# EAGLE schematic Lcd connector (EAGLE 5.08)
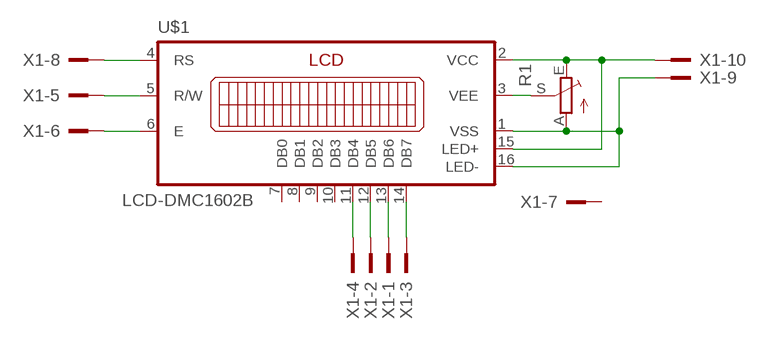
[diagram p0: schematic, sheet 1]

## Parts
R1  TRIM_EU-CA9V  [CA9V]
U$1  LCD-DMC1602B  [DMC1602B]
X1  2510-  [PAK100/2500-10]

## Nets
N$1: U$1.13(DB6) X1.1
N$2: U$1.12(DB5) X1.2
N$3: U$1.14(DB7) X1.3
N$4: U$1.11(DB4) X1.4
N$5: U$1.4(RS) X1.8
N$6: U$1.6(E) X1.6
N$7: U$1.5(R/W) X1.5
N$8: R1.E U$1.2(VCC) U$1.15(LED+) X1.10
N$9: R1.A U$1.1(VSS) U$1.16(LED-) X1.9
N$10: R1.S U$1.3(VEE)
Unconnected: U$1.7(DB0) U$1.8(DB1) U$1.9(DB2) U$1.10(DB3) X1.7

## Library data of the parts
R1 = pot:TRIM_EU-: POTENTIOMETER
U$1 = DodoLcdR2:LCD-DMC1602B: LCD display 16 x 2 backlight
X1 = con-3m:2510-: 3M (TM) Pak 100 4-Wall Header Source: 3M